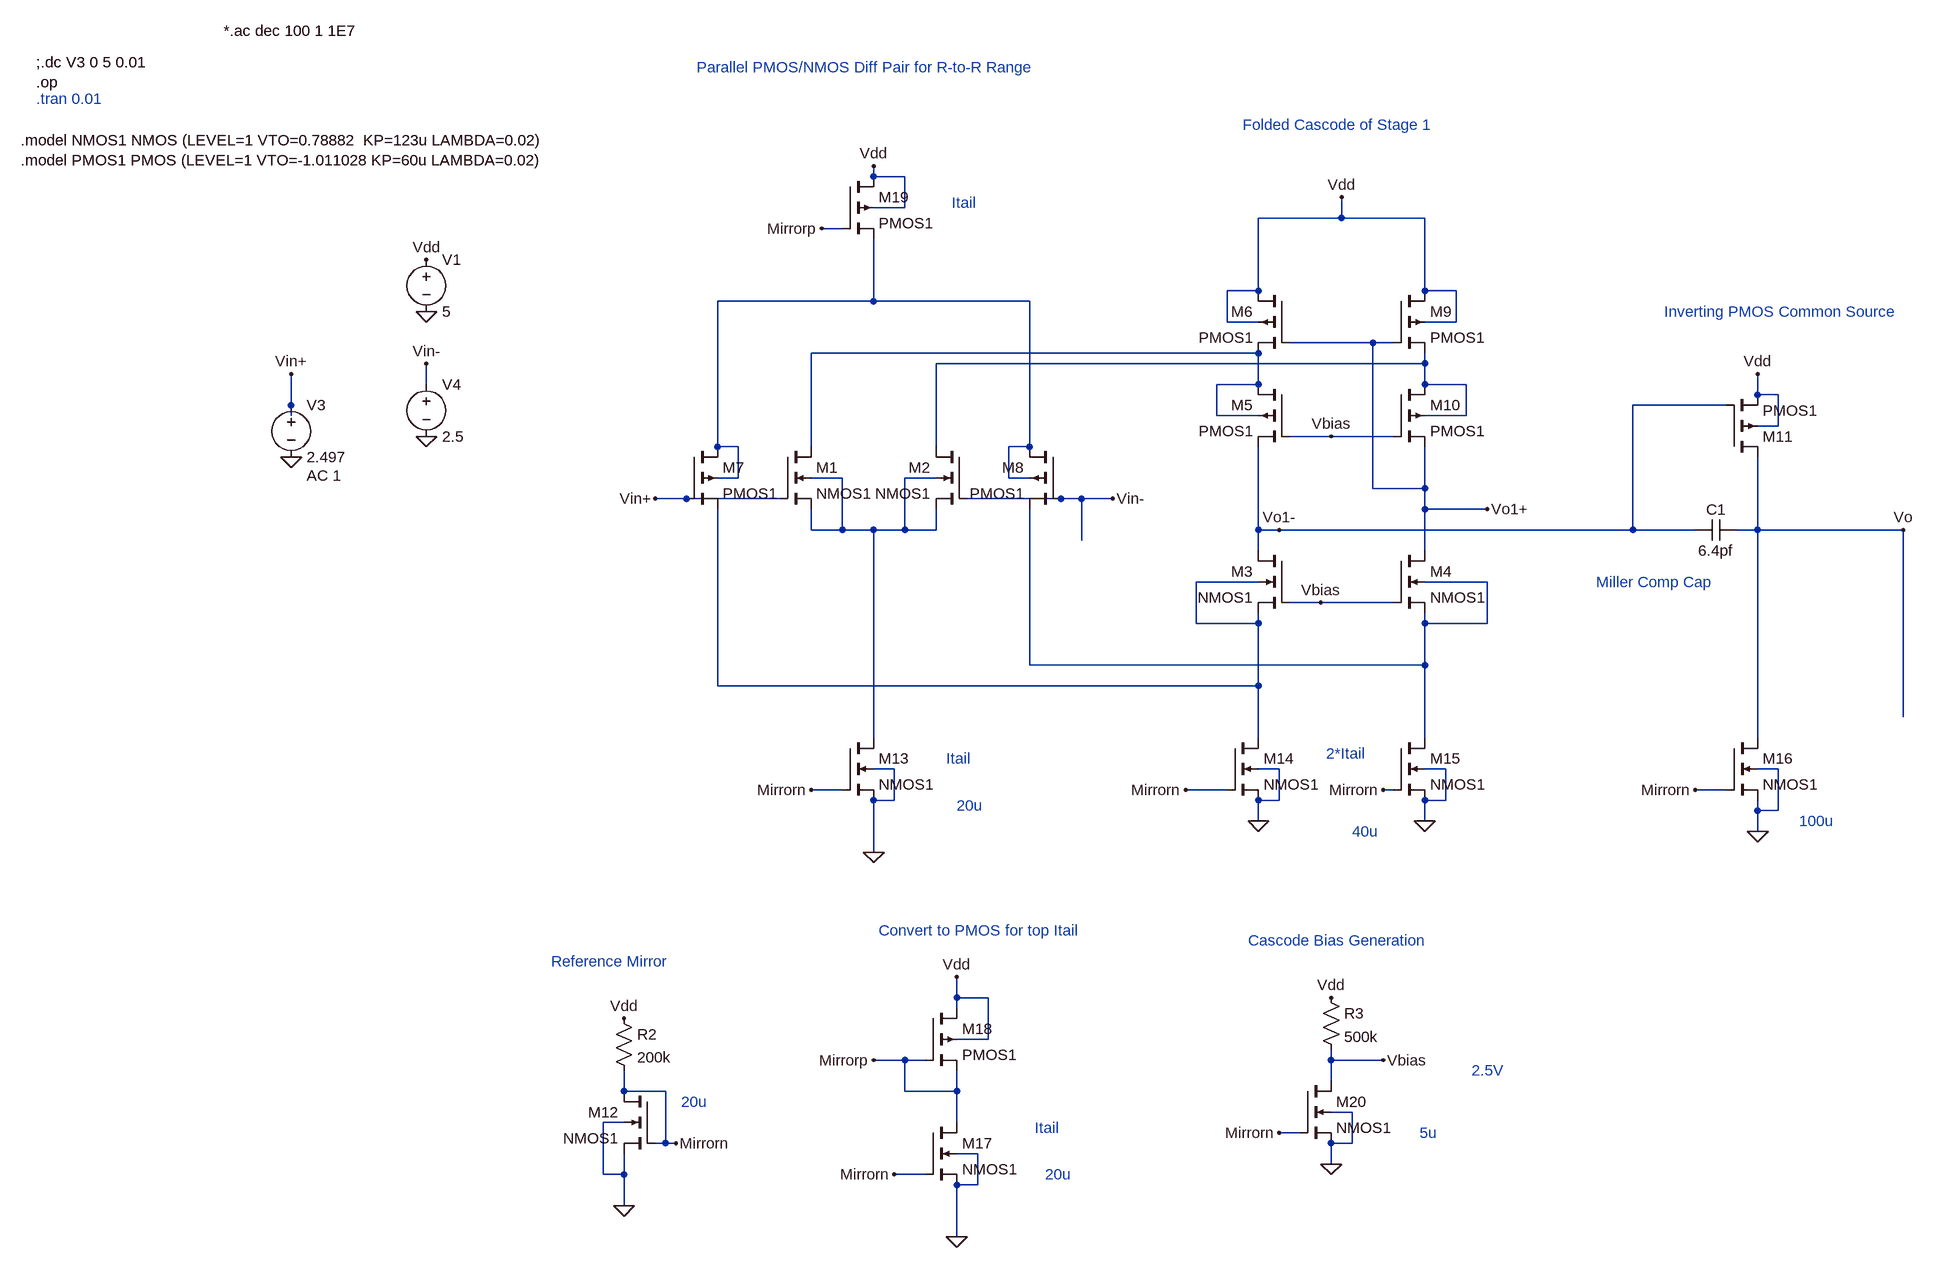
[diagram p0: schematic MOSFET_R2R_Input_Stage_CS_output_tuned_nolevelshift.asc]
MOSFET_R2R_Input_Stage_CS_output_tuned_nolevelshift.asc, the LTspice schematic file:
Version 4.1
SHEET 1 1760 1972
WIRE -96 160 -96 144
WIRE -48 160 -96 160
WIRE -48 208 -48 160
WIRE -48 208 -96 208
WIRE 624 224 624 192
WIRE 624 224 496 224
WIRE 752 224 624 224
WIRE -144 240 -176 240
WIRE 496 336 496 224
WIRE 496 336 448 336
WIRE 752 336 752 224
WIRE 800 336 752 336
WIRE -96 352 -96 256
WIRE -96 352 -336 352
WIRE 144 352 -96 352
WIRE 448 384 448 336
WIRE 496 384 448 384
WIRE 800 384 800 336
WIRE 800 384 752 384
WIRE 672 416 544 416
WIRE 704 416 672 416
WIRE 496 432 -192 432
WIRE 752 448 752 432
WIRE 752 448 0 448
WIRE -784 480 -784 448
WIRE 496 480 496 432
WIRE 496 480 432 480
WIRE 752 480 752 448
WIRE 816 480 752 480
WIRE 1264 496 1264 464
WIRE 1296 496 1264 496
WIRE -992 512 -992 464
WIRE 1216 512 1072 512
WIRE -992 528 -992 512
WIRE 432 528 432 480
WIRE 496 528 432 528
WIRE 816 528 816 480
WIRE 816 528 752 528
WIRE 1296 544 1296 496
WIRE 1296 544 1264 544
WIRE 608 560 544 560
WIRE 704 560 608 560
WIRE -336 576 -336 352
WIRE -304 576 -336 576
WIRE -192 576 -192 432
WIRE 0 576 0 448
WIRE 144 576 144 352
WIRE 144 576 112 576
WIRE -304 624 -304 576
WIRE -304 624 -336 624
WIRE -144 624 -192 624
WIRE 0 624 -48 624
WIRE 112 624 112 576
WIRE 144 624 112 624
WIRE 672 640 672 416
WIRE 752 640 752 576
WIRE 752 640 672 640
WIRE -384 656 -432 656
WIRE -240 656 -384 656
WIRE 192 656 48 656
WIRE 224 656 192 656
WIRE 272 656 224 656
WIRE 752 672 752 640
WIRE 848 672 752 672
WIRE -192 704 -192 672
WIRE -144 704 -144 624
WIRE -144 704 -192 704
WIRE -96 704 -144 704
WIRE -48 704 -48 624
WIRE -48 704 -96 704
WIRE 0 704 0 672
WIRE 0 704 -48 704
WIRE 496 704 496 576
WIRE 528 704 496 704
WIRE 1072 704 1072 512
WIRE 1072 704 528 704
WIRE 1168 704 1072 704
WIRE 1264 704 1264 592
WIRE 1264 704 1232 704
WIRE 1488 704 1264 704
WIRE 224 720 224 656
WIRE 496 736 496 704
WIRE 752 736 752 672
WIRE 496 784 400 784
WIRE 848 784 752 784
WIRE 592 816 544 816
WIRE 704 816 592 816
WIRE 400 848 400 784
WIRE 496 848 496 832
WIRE 496 848 400 848
WIRE 752 848 752 832
WIRE 848 848 848 784
WIRE 848 848 752 848
WIRE 144 912 144 672
WIRE 752 912 752 848
WIRE 752 912 144 912
WIRE -336 944 -336 672
WIRE 496 944 496 848
WIRE 496 944 -336 944
WIRE 1488 992 1488 704
WIRE -96 1024 -96 704
WIRE 496 1024 496 944
WIRE 752 1024 752 912
WIRE 1264 1024 1264 704
WIRE -64 1072 -96 1072
WIRE 528 1072 496 1072
WIRE 784 1072 752 1072
WIRE 1296 1072 1264 1072
WIRE -144 1104 -192 1104
WIRE 448 1104 384 1104
WIRE 704 1104 688 1104
WIRE 1216 1104 1168 1104
WIRE -64 1120 -64 1072
WIRE -64 1120 -96 1120
WIRE 496 1120 496 1104
WIRE 528 1120 528 1072
WIRE 528 1120 496 1120
WIRE 784 1120 784 1072
WIRE 784 1120 752 1120
WIRE 1264 1136 1264 1120
WIRE 1296 1136 1296 1072
WIRE 1296 1136 1264 1136
WIRE 496 1152 496 1120
WIRE 752 1152 752 1120
WIRE 1264 1168 1264 1136
WIRE -96 1200 -96 1120
WIRE 32 1424 32 1392
WIRE 80 1424 32 1424
WIRE 32 1440 32 1424
WIRE 80 1488 80 1424
WIRE 80 1488 32 1488
WIRE -48 1520 -96 1520
WIRE -16 1520 -48 1520
WIRE 608 1520 608 1504
WIRE 688 1520 608 1520
WIRE 608 1552 608 1520
WIRE -480 1568 -480 1536
WIRE -416 1568 -480 1568
WIRE -48 1568 -48 1520
WIRE 32 1568 32 1536
WIRE 32 1568 -48 1568
WIRE 640 1600 608 1600
WIRE -480 1616 -512 1616
WIRE 32 1616 32 1568
WIRE 560 1632 528 1632
WIRE -416 1648 -416 1568
WIRE -416 1648 -432 1648
WIRE -400 1648 -416 1648
WIRE 640 1648 640 1600
WIRE 640 1648 608 1648
WIRE 64 1664 32 1664
WIRE 608 1680 608 1648
WIRE -512 1696 -512 1616
WIRE -480 1696 -480 1664
WIRE -480 1696 -512 1696
WIRE -16 1696 -64 1696
WIRE 64 1712 64 1664
WIRE 64 1712 32 1712
WIRE -480 1744 -480 1696
WIRE 32 1792 32 1712
FLAG 272 656 Vin-
FLAG -432 656 Vin+
FLAG -784 368 0
FLAG -784 288 Vdd
FLAG -96 144 Vdd
FLAG 496 1152 0
FLAG 752 1152 0
FLAG 624 192 Vdd
FLAG -992 592 0
FLAG -784 560 0
FLAG -992 464 Vin+
FLAG -784 448 Vin-
FLAG 1264 464 Vdd
FLAG 1488 704 Vo
FLAG 1264 1168 0
FLAG 848 672 Vo1+
FLAG 528 704 Vo1-
FLAG -480 1456 Vdd
FLAG -480 1744 0
FLAG -96 1200 0
FLAG -400 1648 Mirrorn
FLAG -192 1104 Mirrorn
FLAG 384 1104 Mirrorn
FLAG 688 1104 Mirrorn
FLAG 1168 1104 Mirrorn
FLAG 32 1792 0
FLAG -64 1696 Mirrorn
FLAG 32 1392 Vdd
FLAG -96 1520 Mirrorp
FLAG -176 240 Mirrorp
FLAG 528 1632 Mirrorn
FLAG 608 1680 0
FLAG 608 1424 Vdd
FLAG 688 1520 Vbias
FLAG 592 816 Vbias
FLAG 608 560 Vbias
DATAFLAG 816 672 ""
DATAFLAG 416 944 ""
DATAFLAG 656 912 ""
DATAFLAG 496 672 ""
DATAFLAG -272 352 ""
DATAFLAG -96 816 ""
DATAFLAG 1088 512 ""
DATAFLAG 1376 704 ""
SYMBOL nmos4 -240 576 R0
SYMATTR InstName M1
SYMATTR Value NMOS1
SYMATTR Value2 l=0.5u w=0.5u
SYMBOL nmos4 48 576 M0
SYMATTR InstName M2
SYMATTR Value NMOS1
SYMATTR Value2 l=0.5u w=0.5u
SYMBOL pmos4 -384 576 R0
SYMATTR InstName M7
SYMATTR Value PMOS1
SYMATTR Value2 l=0.5u w=1u
SYMBOL pmos4 192 576 M0
SYMATTR InstName M8
SYMATTR Value PMOS1
SYMATTR Value2 l=0.5u w=1u
SYMBOL voltage -784 272 R0
WINDOW 123 0 0 Left 0
WINDOW 39 0 0 Left 0
SYMATTR InstName V1
SYMATTR Value 5
SYMBOL nmos4 544 736 M0
SYMATTR InstName M3
SYMATTR Value NMOS1
SYMATTR Value2 l=0.5u w=0.5u
SYMBOL nmos4 704 736 R0
SYMATTR InstName M4
SYMATTR Value NMOS1
SYMATTR Value2 l=0.5u w=0.5u
SYMBOL pmos4 544 480 M0
SYMATTR InstName M5
SYMATTR Value PMOS1
SYMATTR Value2 l=0.5u w=1u
SYMBOL pmos4 544 336 M0
SYMATTR InstName M6
SYMATTR Value PMOS1
SYMATTR Value2 l=0.5u w=2u
SYMBOL pmos4 704 336 R0
SYMATTR InstName M9
SYMATTR Value PMOS1
SYMATTR Value2 l=0.5u w=2u
SYMBOL pmos4 704 480 R0
SYMATTR InstName M10
SYMATTR Value PMOS1
SYMATTR Value2 l=0.5u w=1u
SYMBOL voltage -992 496 R0
WINDOW 123 24 124 Left 2
WINDOW 39 0 0 Left 0
SYMATTR Value2 AC 1
SYMATTR InstName V3
SYMATTR Value 2.497
SYMBOL voltage -784 464 R0
WINDOW 123 0 0 Left 0
WINDOW 39 0 0 Left 0
SYMATTR InstName V4
SYMATTR Value 2.5
SYMBOL cap 1232 688 R90
WINDOW 0 0 32 VBottom 2
WINDOW 3 32 32 VTop 2
SYMATTR InstName C1
SYMATTR Value 6.4pf
SYMBOL pmos4 1216 592 M180
SYMATTR InstName M11
SYMATTR Value PMOS1
SYMATTR Value2 l=0.5u w=5u
SYMBOL res -496 1440 R0
SYMATTR InstName R2
SYMATTR Value 200k
SYMBOL nmos4 -432 1568 M0
SYMATTR InstName M12
SYMATTR Value NMOS1
SYMATTR Value2 l=0.5u w=4u
SYMBOL nmos4 -144 1024 R0
SYMATTR InstName M13
SYMATTR Value NMOS1
SYMATTR Value2 l=0.5u w=4u
SYMBOL nmos4 448 1024 R0
SYMATTR InstName M14
SYMATTR Value NMOS1
SYMATTR Value2 l=0.5u w=8u
SYMBOL nmos4 704 1024 R0
SYMATTR InstName M15
SYMATTR Value NMOS1
SYMATTR Value2 l=0.5u w=8u
SYMBOL nmos4 1216 1024 R0
SYMATTR InstName M16
SYMATTR Value NMOS1
SYMATTR Value2 l=0.5u w=20u
SYMBOL nmos4 -16 1616 R0
SYMATTR InstName M17
SYMATTR Value NMOS1
SYMATTR Value2 l=0.5u w=4u
SYMBOL pmos4 -16 1440 R0
SYMATTR InstName M18
SYMATTR Value PMOS1
SYMATTR Value2 l=0.5u w=4u
SYMBOL pmos4 -144 160 R0
SYMATTR InstName M19
SYMATTR Value PMOS1
SYMATTR Value2 l=0.5u w=4u
SYMBOL nmos4 560 1552 R0
SYMATTR InstName M20
SYMATTR Value NMOS1
SYMATTR Value2 l=0.5u w=1u
SYMBOL res 592 1408 R0
SYMATTR InstName R3
SYMATTR Value 500k
TEXT 24 200 Left 2 ;Itail
TEXT 16 1056 Left 2 ;Itail
TEXT 600 1048 Left 2 ;2*Itail
TEXT -1408 104 Left 2 !.model NMOS1 NMOS (LEVEL=1 VTO=0.78882  KP=123u LAMBDA=0.02)\n.model PMOS1 PMOS (LEVEL=1 VTO=-1.011028 KP=60u LAMBDA=0.02)
TEXT -1384 -16 Left 2 !;.dc V3 0 5 0.01\n.op
TEXT 1120 368 Left 2 ;Inverting PMOS Common Source
TEXT 1016 784 Left 2 ;Miller Comp Cap
TEXT -368 -8 Left 2 ;Parallel PMOS/NMOS Diff Pair for R-to-R Range
TEXT -392 1584 Left 2 ;20u
TEXT 32 1128 Left 2 ;20u
TEXT 640 1168 Left 2 ;40u
TEXT 1328 1152 Left 2 ;100u
TEXT 152 1624 Left 2 ;Itail
TEXT 168 1696 Left 2 ;20u
TEXT -592 1368 Left 2 ;Reference Mirror
TEXT -88 1320 Left 2 ;Convert to PMOS for top Itail
TEXT 744 1632 Left 2 ;5u
TEXT 480 1336 Left 2 ;Cascode Bias Generation
TEXT -1096 -64 Left 2 !*.ac dec 100 1 1E7
TEXT -1384 40 Left 2 ;.tran 0.01
TEXT 824 1536 Left 2 ;2.5V
TEXT 472 80 Left 2 ;Folded Cascode of Stage 1

The netlist it stands for:
* MOSFET_R2R_Input_Stage_CS_output_tuned_nolevelshift.asc
M1 N002 Vin+ N004 N004 NMOS1 l=0.5u w=0.5u
M2 N003 Vin- N004 N004 NMOS1 l=0.5u w=0.5u
M7 N001 Vin+ N005 N001 PMOS1 l=0.5u w=1u
M8 N001 Vin- N006 N001 PMOS1 l=0.5u w=1u
V1 Vdd 0 5
M3 Vo1- Vbias N005 N005 NMOS1 l=0.5u w=0.5u
M4 Vo1+ Vbias N006 N006 NMOS1 l=0.5u w=0.5u
M5 N002 Vbias Vo1- N002 PMOS1 l=0.5u w=1u
M6 Vdd Vo1+ N002 Vdd PMOS1 l=0.5u w=2u
M9 Vdd Vo1+ N003 Vdd PMOS1 l=0.5u w=2u
M10 N003 Vbias Vo1+ N003 PMOS1 l=0.5u w=1u
V3 Vin+ 0 2.497 AC 1
V4 Vin- 0 2.5
C1 Vo Vo1- 6.4pf
M11 Vo Vo1- Vdd Vdd PMOS1 l=0.5u w=5u
R2 Vdd Mirrorn 200k
M12 Mirrorn Mirrorn 0 0 NMOS1 l=0.5u w=4u
M13 N004 Mirrorn 0 0 NMOS1 l=0.5u w=4u
M14 N005 Mirrorn 0 0 NMOS1 l=0.5u w=8u
M15 N006 Mirrorn 0 0 NMOS1 l=0.5u w=8u
M16 Vo Mirrorn 0 0 NMOS1 l=0.5u w=20u
M17 Mirrorp Mirrorn 0 0 NMOS1 l=0.5u w=4u
M18 Vdd Mirrorp Mirrorp Vdd PMOS1 l=0.5u w=4u
M19 Vdd Mirrorp N001 Vdd PMOS1 l=0.5u w=4u
M20 Vbias Mirrorn 0 0 NMOS1 l=0.5u w=1u
R3 Vdd Vbias 500k
.model NMOS NMOS
.model PMOS PMOS
.lib standard.mos
* Itail
* Itail
* 2*Itail
.model NMOS1 NMOS (LEVEL=1 VTO=0.78882  KP=123u LAMBDA=0.02)
.model PMOS1 PMOS (LEVEL=1 VTO=-1.011028 KP=60u LAMBDA=0.02)
;.dc V3 0 5 0.01
.op
* Inverting PMOS Common Source
* Miller Comp Cap
* Parallel PMOS/NMOS Diff Pair for R-to-R Range
* 20u
* 20u
* 40u
* 100u
* Itail
* 20u
* Reference Mirror
* Convert to PMOS for top Itail
* 5u
* Cascode Bias Generation
*.ac dec 100 1 1E7
* .tran 0.01
* 2.5V
* Folded Cascode of Stage 1
.backanno
.end